# EAGLE design uC_Board (EAGLE 7.1.0)
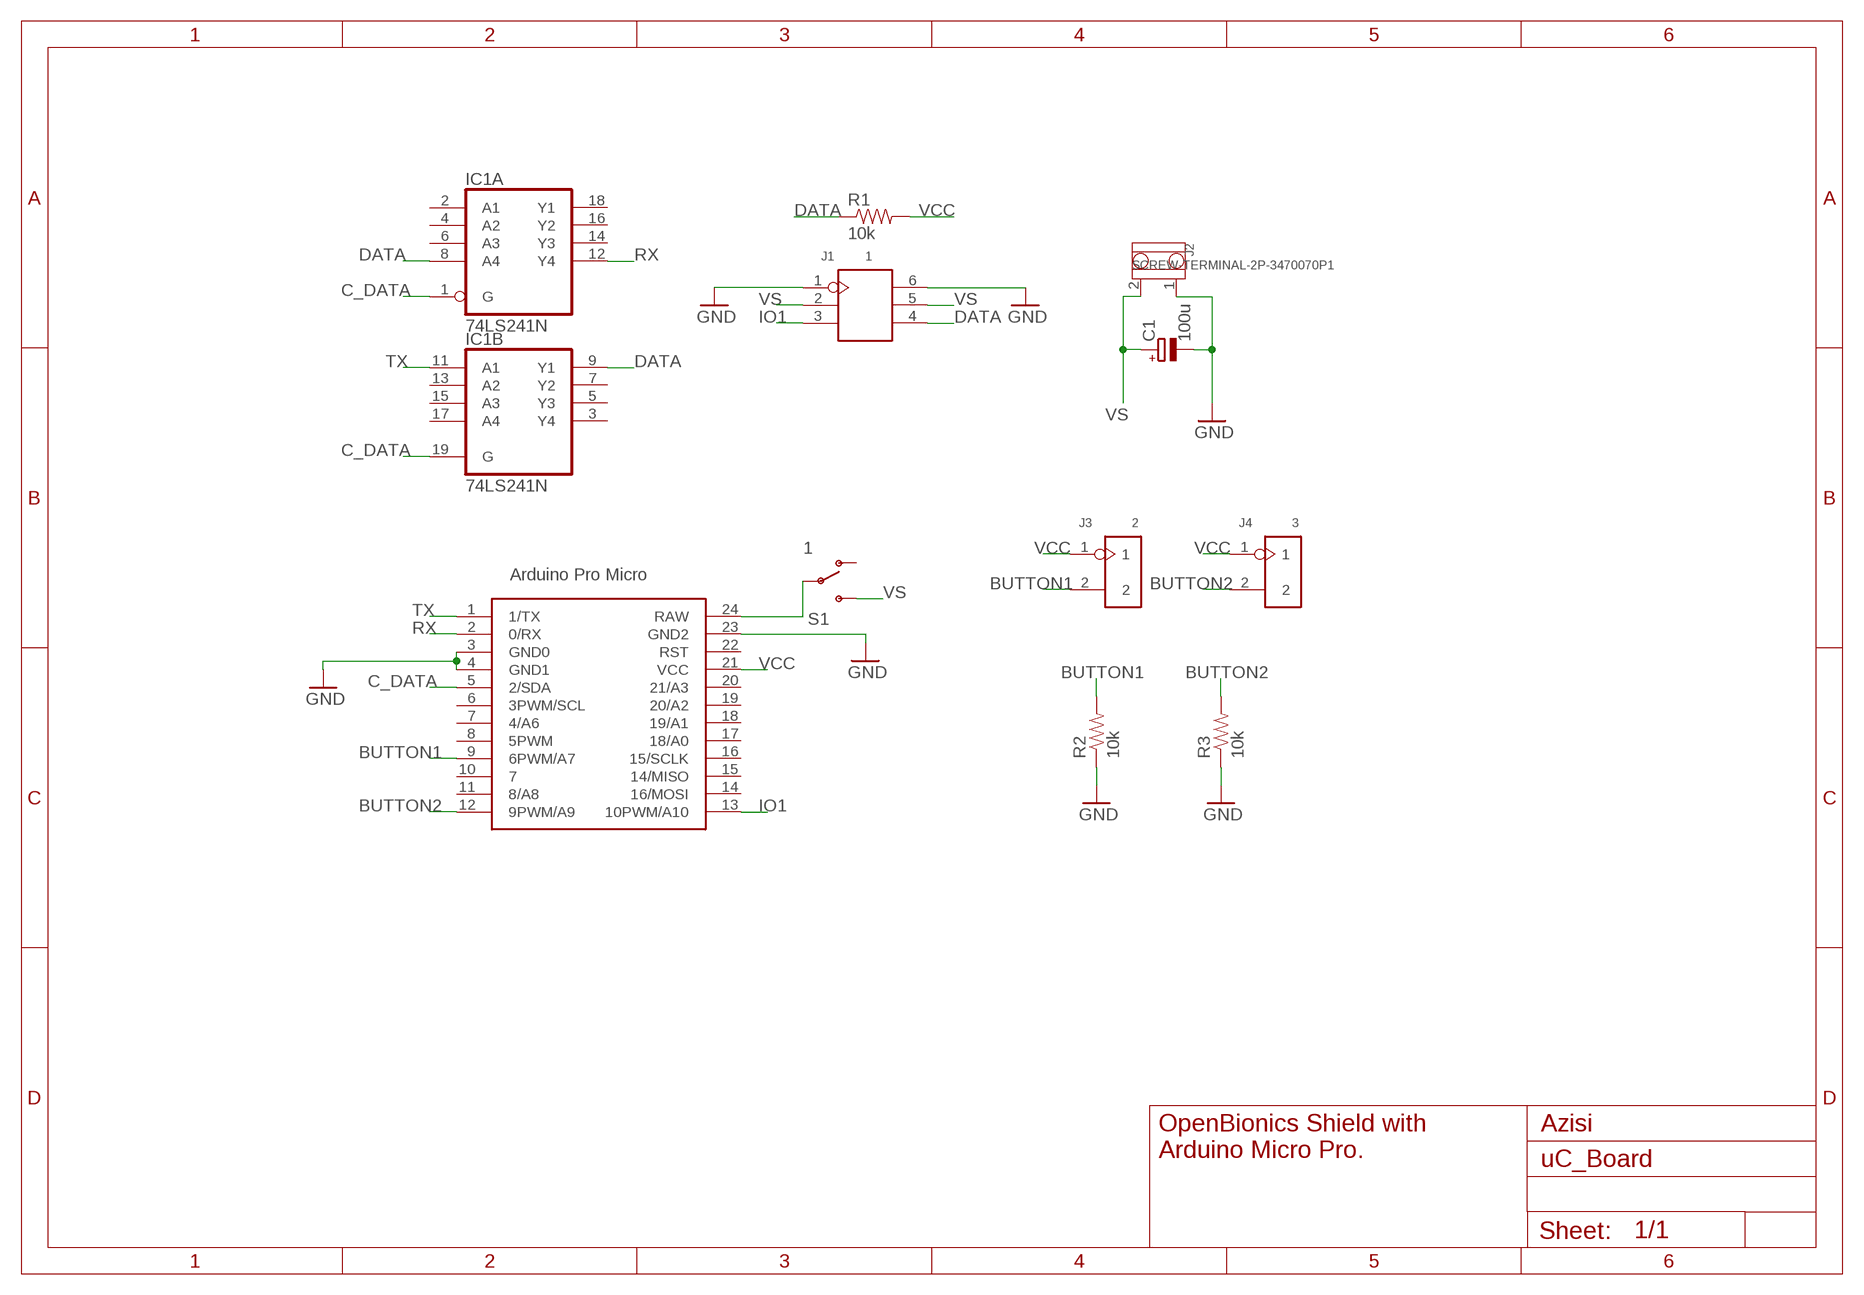
[diagram p0: schematic, sheet 1]

## Parts
ARDUINO_MICRO  ARDUINO_PRO_MICROARDUINO_BOARD  [ARDUINO_MICRO_PRO]
C1  100u  CPOL-EUE2.5-6  [E2,5-6]
IC1  74LS241N  [DIL20]
J1  1  HEADER-2X3P-2.54  [2X3P-2.54-65/35MIL]
J2  SCREW-TERMINAL-2P-3470070P1  [2P-3.5]
J3  2  HEADER-2P-65/35MIL  [2P-2.54-65/35MIL]
J4  3  HEADER-2P-65/35MIL  [2P-2.54-65/35MIL]
R1  10k  RESISTOR1206  [1206]
R2  10k  RESISTOR1206  [1206]
R3  10k  RESISTOR1206  [1206]
S1  1  SWITCH-SPDTSMD2  [SWITCH-SPDT-SMD]

## Nets
BUTTON1: ARDUINO_MICRO.9(6PWM/A7) J3.2 R2.2
BUTTON2: ARDUINO_MICRO.12(9PWM/A9) J4.2 R3.2
C_DATA: ARDUINO_MICRO.5(2/SDA) IC1.1(A:G) IC1.19(B:G)
DATA: IC1.8(A:A4) IC1.9(B:Y1) J1.4 R1.1
GND: ARDUINO_MICRO.3(GND0) ARDUINO_MICRO.4(GND1) ARDUINO_MICRO.23(GND2) C1.- J1.1 J1.6 J2.1 R2.1 R3.1
IO1: ARDUINO_MICRO.13(10PWM/A10) J1.3
N$1: ARDUINO_MICRO.24(RAW) S1.2(P)
RX: ARDUINO_MICRO.2(0/RX) IC1.12(A:Y4)
TX: ARDUINO_MICRO.1(1/TX) IC1.11(B:A1)
VCC: ARDUINO_MICRO.21(VCC) J3.1 J4.1 R1.2
VS: C1.+ J1.2 J1.5 J2.2 S1.3(S)
Unconnected: ARDUINO_MICRO.6(3PWM/SCL) ARDUINO_MICRO.7(4/A6) ARDUINO_MICRO.8(5PWM) ARDUINO_MICRO.10 ARDUINO_MICRO.11(8/A8) ARDUINO_MICRO.14(16/MOSI) ARDUINO_MICRO.15(14/MISO) ARDUINO_MICRO.16(15/SCLK) ARDUINO_MICRO.17(18/A0) ARDUINO_MICRO.18(19/A1) ARDUINO_MICRO.19(20/A2) ARDUINO_MICRO.20(21/A3) ARDUINO_MICRO.22(RST) IC1.2(A:A1) IC1.3(B:Y4) IC1.4(A:A2) IC1.5(B:Y3) IC1.6(A:A3) IC1.7(B:Y2) IC1.13(B:A2) IC1.14(A:Y3) IC1.15(B:A3) IC1.16(A:Y2) IC1.17(B:A4) IC1.18(A:Y1) S1.1(O)

## Notes on the sheet
- Azisi
- OpenBionics Shield with
  Arduino Micro Pro.

## Power pins joined to a net without a drawn wire
GND: IC1.10(P:GND)
VCC: IC1.20(P:VCC)

## Library data of the parts
ARDUINO_MICRO = OpenBionics:ARDUINO_PRO_MICRO: Breakout Board for arduino micro pro.
C1 = rcl:CPOL-EU: POLARIZED CAPACITOR, European symbol
IC1 = 74xx-eu:74*241: Octal BUFFER and LINE DRIVER, 3-state
J1 = Connector:HEADER-2X3P
J2 = Connector:SCREW-TERMINAL-2P
J3 J4 = Connector:HEADER-2P
R1-R3 = SparkFun-Passives:RESISTOR: Resistor Basic schematic elements and footprints for 0603, 1206, and PTH resistors.
S1 = SparkFun-Electromechanical:SWITCH-SPDT: SPDT Switch Simple slide switch, Spark Fun Electronics SKU : COM-00102 DPDT SMT slide switch, AYZ0202, SWCH-08179

## Board
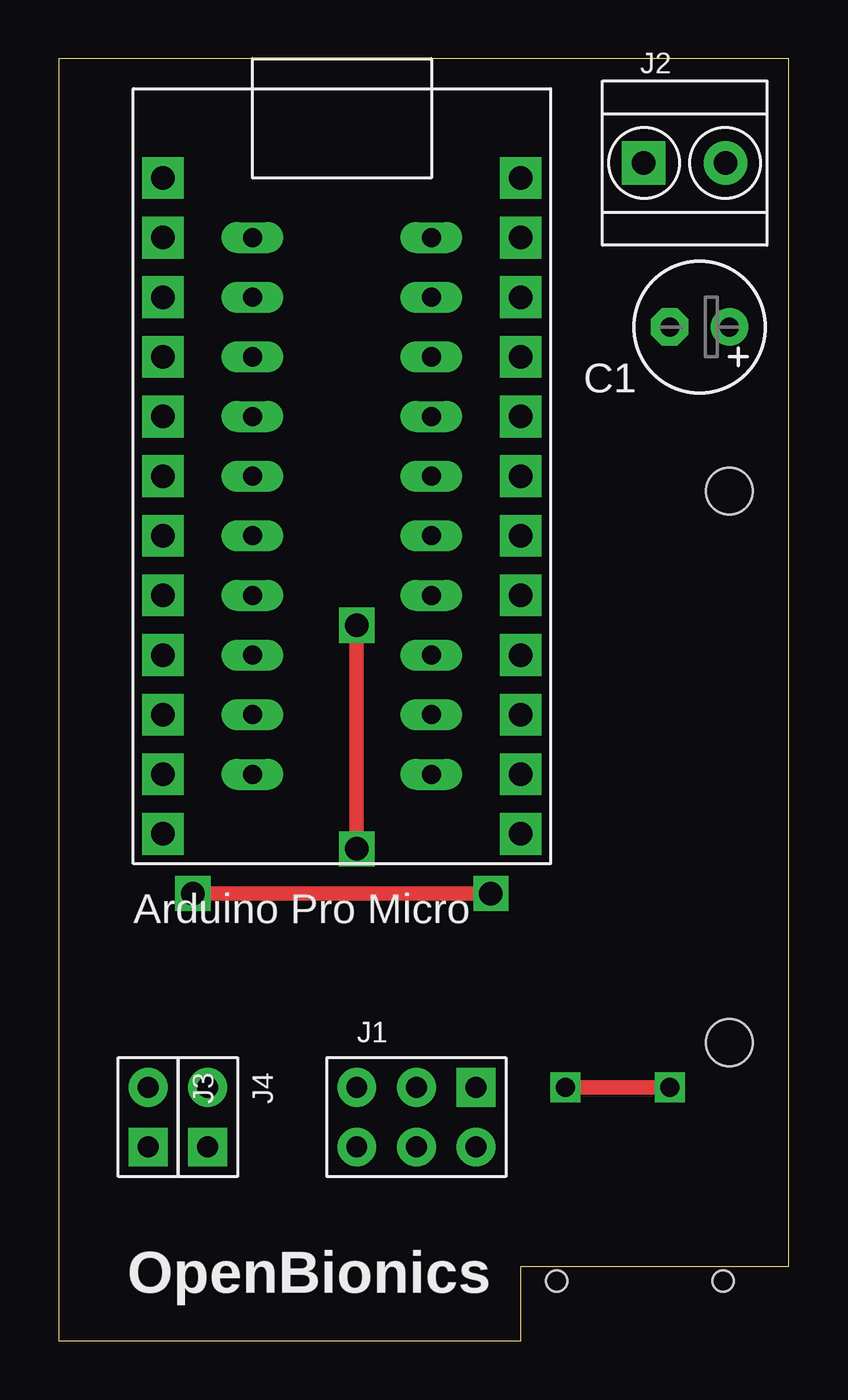
[diagram p1: board, top side]
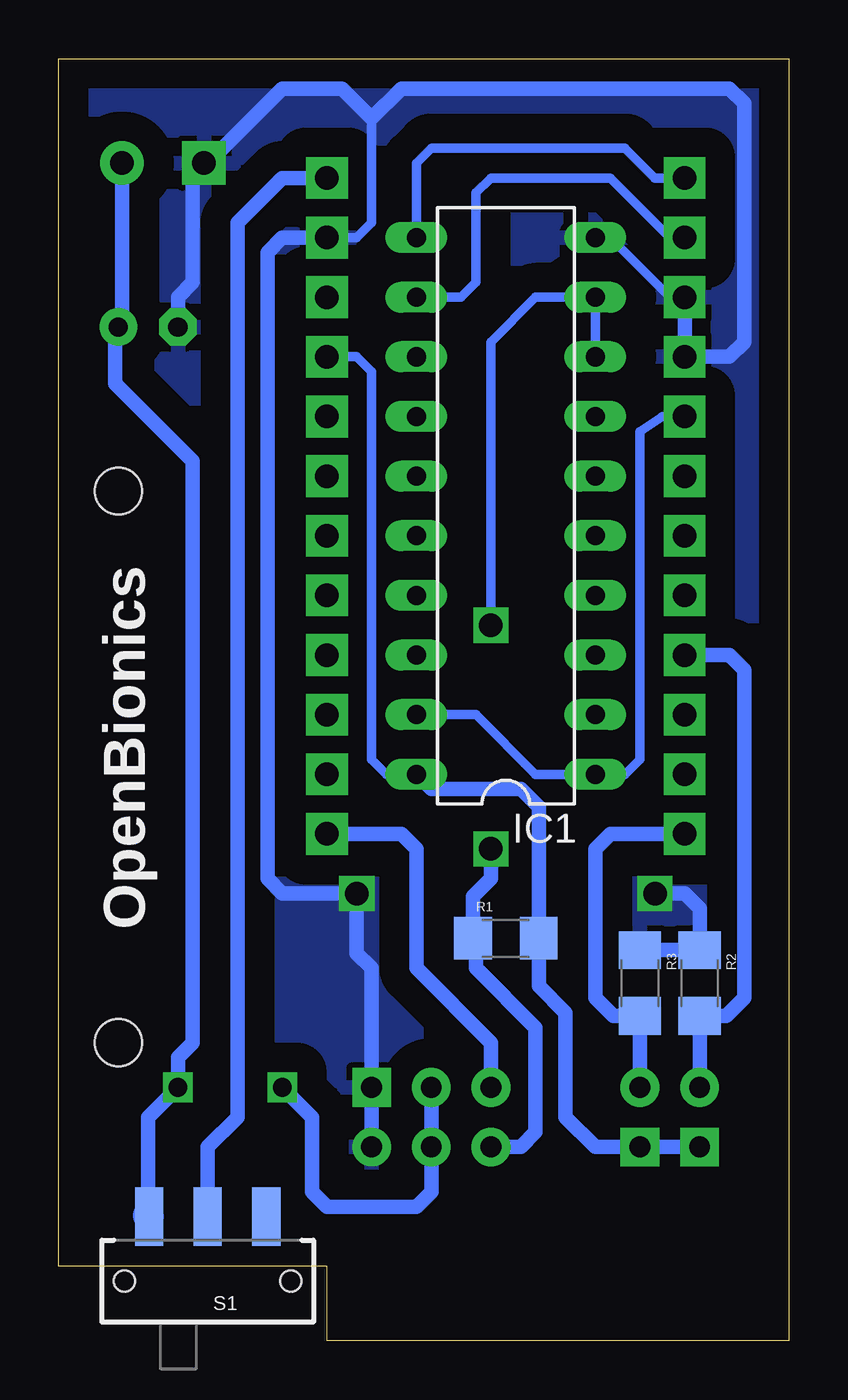
[diagram p2: board, bottom side, seen from below]

Size 31.11 x 54.61 mm. Coordinates in mm from the lower left corner, seen from the top.
Outline: 31.1,54.6 0,54.6 0,0 19.68,0 19.68,3.17 31.11,3.17 31.11,54.61
Copper layers (1*16): Top 0.035mm / dielectric 1.5mm / Bottom 0.035mm
Design rules "SeeedStudio_2layer_DRU_no_angle_20140221": minimum track width 6mil, minimum drill 12mil, track to track 6mil, track to pad 6mil, pad to pad 6mil, via to via 6mil, smd to smd 0mil, copper to edge 10mil, drill to drill 10mil, minimum pad ring 10mil, minimum via ring 6mil, stop-mask expansion 2mil, vias tented up to drill 100mil, thermal gap 10mil
Holes 2 mm at 28.58,36.2 28.58,12.7

### Footprints (pad centres in the part's own frame; a part is rotated, then mirrored left to right if it is on the bottom)
ARDUINO_MICRO_PRO = drill 1 pad 1.778 square: 1 -7.62,12.7; 2 -7.62,10.16; 3 -7.62,7.62; 4 -7.62,5.08; 5 -7.62,2.54; 6 -7.62,0; 7 -7.62,-2.54; 8 -7.62,-5.08; 9 -7.62,-7.62; 10 -7.62,-10.16; 11 -7.62,-12.7; 12 -7.62,-15.24; 13 7.62,-15.24; 14 7.62,-12.7; 15 7.62,-10.16; 16 7.62,-7.62; 17 7.62,-5.08; 18 7.62,-2.54; 19 7.62,0; 20 7.62,2.54; 21 7.62,5.08; 22 7.62,7.62; 23 7.62,10.16; 24 7.62,12.7
E2,5-6 = drill 0.813 pad 1.6: + -1.27,0 | drill 0.813 pad 1.6 octagon: - 1.27,0
DIL20 = drill 0.813 long: 1 -11.43,-3.81; 2 -8.89,-3.81; 3 -6.35,-3.81; 4 -3.81,-3.81; 5 -1.27,-3.81; 6 1.27,-3.81; 7 3.81,-3.81; 8 6.35,-3.81; 9 8.89,-3.81; 10 11.43,-3.81; 11 11.43,3.81; 12 8.89,3.81; 13 6.35,3.81; 14 3.81,3.81; 15 1.27,3.81; 16 -1.27,3.81; 17 -3.81,3.81; 18 -6.35,3.81; 19 -8.89,3.81; 20 -11.43,3.81
2X3P-2.54-65/35MIL = drill 0.889 pad 1.651 square: 1 -1.27,2.54 | drill 0.889 pad 1.651: 2 -1.27,0; 3 -1.27,-2.54; 4 1.27,-2.54; 5 1.27,0; 6 1.27,2.54
2P-3.5 = drill 1 pad 1.85 square: 1 -1.75,0 | drill 1 pad 1.85: 2 1.75,0
2P-2.54-65/35MIL = drill 0.889 pad 1.651 square: 1 0,1.27 | drill 0.889 pad 1.651: 2 0,-1.27
1206 = smd 1.6 x 1.8: 1 -1.4,0; 2 1.4,0
SWITCH-SPDT-SMD = smd 1.2 x 2.5: 1 -2.5,-2.75; 2 0,-2.75; 3 2.5,-2.75 | hole 0.9: -3.55,0; 3.55,0

### Placement (x,y rotation side)
ARDUINO_MICRO  12.06,36.83 0 top
C1  27.3,43.18 180 top
IC1  12.06,35.56 90 bottom
J1  15.24,9.53 270 top
J2  26.67,50.16 0 top
J3  3.81,9.53 180 top
J4  6.35,9.53 180 top
R1  12.06,17.14 0 bottom
R2  3.81,15.24 270 bottom
R3  6.35,15.24 270 bottom
S1  24.77,2.54 180 bottom

### Tracks (layer width: path | path; a pad name or v marks a point on that pad's centre or on a via)
BUTTON1
  Bottom 0.61: ARDUINO_MICRO.9 2.54,29.21 1.91,28.57 1.91,14.6 2.67,13.84 R2.2 J3.2
BUTTON2
  Bottom 0.61: ARDUINO_MICRO.12 7.62,21.59 8.25,20.95 8.25,14.6 7.49,13.84 R3.2 J4.2
C_DATA
  Bottom 0.406: ARDUINO_MICRO.5 5.4,39.37 6.35,38.73 6.35,24.77 6.98,24.13 IC1.1 10.79,24.13 13.34,26.67 IC1.19
DATA  (via drill 1 pad 1.27)
  Top 0.61: v12.7,30.48 v12.7,20.95
  Bottom 0.406: v12.7,30.48 12.7,42.54 10.79,44.45 IC1.9 IC1.8
  Bottom 0.61: v12.7,20.95 12.7,19.68 13.46,18.92 R1.1 13.34,17.02 13.34,15.87 10.79,13.33 10.79,8.89 11.43,8.26 J1.4
GND  (via drill 1 pad 1.27)
  Top 0.61: v5.71,19.05 v18.41,19.05
  Bottom 0.406: ARDUINO_MICRO.23 18.41,46.99 17.78,47.62 17.78,52.07 | ARDUINO_MICRO.3 5.08,44.45 7.62,46.99 IC1.10
  Bottom 0.61: ARDUINO_MICRO.3 ARDUINO_MICRO.4 2.54,41.91 1.91,42.54 1.91,52.7 2.54,53.34 16.51,53.34 17.78,52.07 19.05,53.34 21.59,53.34 24.77,50.16 | ARDUINO_MICRO.23 21.59,46.99 22.22,46.35 22.22,19.68 21.59,19.05 v18.41,19.05 18.41,16.51 17.78,15.87 J1.1 J1.6 | R3.1 R2.1 3.81,18.41 4.45,19.05 v5.71,19.05 | C1.- 26.03,44.45 25.4,45.09 25.4,49.68 J2.1
  pour Bottom (isolate 1.27): 31.11,54.61 0,54.61 0,0 31.11,0
IO1
  Bottom 0.61: ARDUINO_MICRO.13 16.51,21.59 15.88,20.95 15.88,15.87 12.7,12.7 J1.3
N$1
  Bottom 0.61: ARDUINO_MICRO.24 21.59,49.53 23.49,47.62 23.49,9.53 24.77,8.26 S1.2
RX
  Bottom 0.406: ARDUINO_MICRO.2 5.08,46.99 7.62,49.53 12.7,49.53 13.34,48.9 13.34,45.09 13.97,44.45 IC1.12
TX
  Bottom 0.406: ARDUINO_MICRO.1 5.71,49.53 6.98,50.8 15.24,50.8 15.88,50.16 IC1.11
VCC
  Bottom 0.406: ARDUINO_MICRO.21 18.41,41.91 17.78,41.27 17.78,24.77 17.14,24.13 IC1.20
  Bottom 0.61: J3.1 J4.1 8.25,8.26 9.52,9.53 9.52,13.97 10.66,15.11 R1.2 10.66,22.73 11.43,23.49 15.24,23.49 IC1.20
VS  (via drill 0.8 pad 1.27)
  Top 0.61: v21.59,10.79 v26.03,10.79
  Bottom 0.61: 27.3,5.25 S1.3 | J1.2 J1.5 15.24,6.35 15.88,5.71 19.68,5.71 20.32,6.35 20.32,9.53 v21.59,10.79 | 27.3,5.33 27.3,9.53 v26.03,10.79 26.03,12.06 25.4,12.7 25.4,37.46 28.7,40.77 28.7,43.05 C1.+ 28.42,43.34 J2.2
  Bottom 1.27: 27.3,5.33 S1.3

### Text on the board
tPlace: OpenBionics
bPlace: OpenBionics